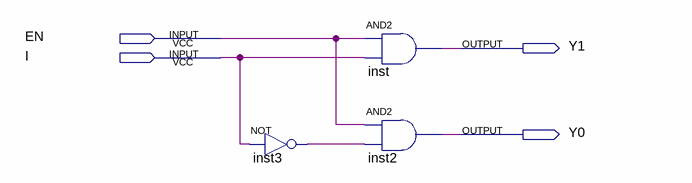
[diagram p0: schematic sheet]
// Quartus schematic DECODER_2TO1.bdf as structural Verilog: 3 symbols, 4 pins
module DECODER_2TO1 (
  input  EN,
  input  I,
  output Y1,
  output Y0
);

  wire inst3_out;

  not inst3 (inst3_out, I);
  and inst (Y1, EN, I);
  and inst2 (Y0, EN, inst3_out);
endmodule
